# Altium schematic sheet Buzzer.SchDoc
size A4
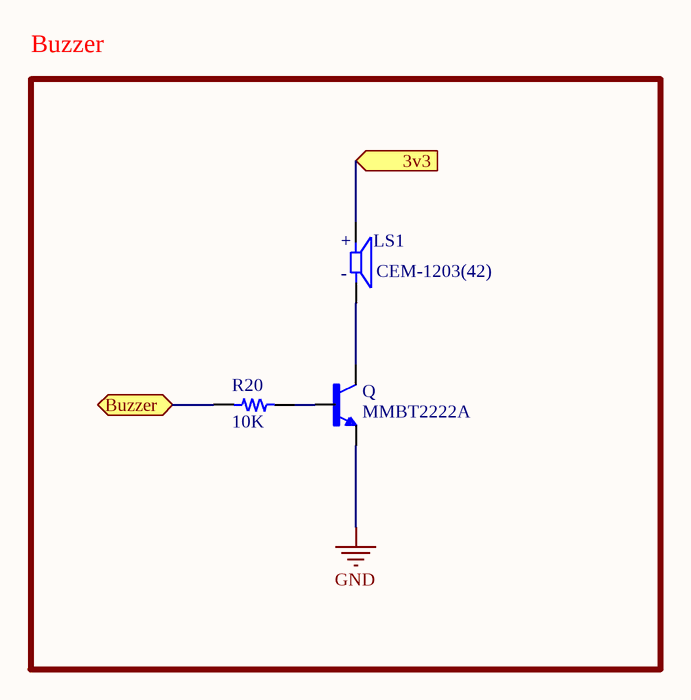
[diagram p0: Buzzer.SchDoc]

## Parts
LS1  CEM-1203(42)  [CUI_CEM-1203(42)]
Q  MMBT2222A  [SOT23]
R20  10K  [RES 0805_2012]

## Blocks framed on the sheet
Buzzer: LS1 Q R20

## Ports
3v3 (in), Buzzer (bidir)

## Nets
GND: Q.2(E)
3v3: LS1.P ; port 3v3
Buzzer: R20.1 ; port Buzzer
NetLS1_N: LS1.N Q.3(C)
NetQ_1: Q.1(B) R20.2

## Notes on the sheet
- Title
- Size:
- Date:
- A4
- Number:
- Time:
- Revision:
- Sheet
- of
- File:
- (in symbol CEM-1203(42)) +; -

## Library data of the parts
LS1 = CEM-1203(42): 12 mm, 3.5 V, 85 dB, Through Hole, Magnetic Audio Transducer Buzzer; MF: CUI Devices; Package: None; Price: None; Check_prices: https://www.snapeda.com/parts/CEM-1203(42)/CUI+Devices/view-part/?ref=eda; Value: *; CUI_purchase_URL: https://www.cuidevices.com/product/audio/buzzers/audio-transducers/cem-1203(42)?utm_source=snapeda.com&utm_medium=referral&utm_campaign=snapedaBOM; SnapEDA_Link: https://www.snapeda.com/parts/CEM-1203(42)/CUI+Devices/view-part/?ref=snap; MP: CEM-1203(42); Availability: In Stock; Purchase-URL: https://pricing.snapeda.com/search/part/CEM-1203(42)/?ref=eda
Q = MMBT2222A: Bipolar _BJT_ Transistor NPN 40V 600mA 270MHz 350mW Surface Mount SOT-23-3; MF: STMicroelectronics; Package: TO-236-3 Taitron; Availability: Unavailable; MP: MMBT2222A; Value: *; SnapEDA_Link: https://www.snapeda.com/parts/MMBT2222A/STMicroelectronics/view-part/1642048/?ref=snap; Price: None
R20 = Res 0805: SMT Resistor; VALUE: 1K